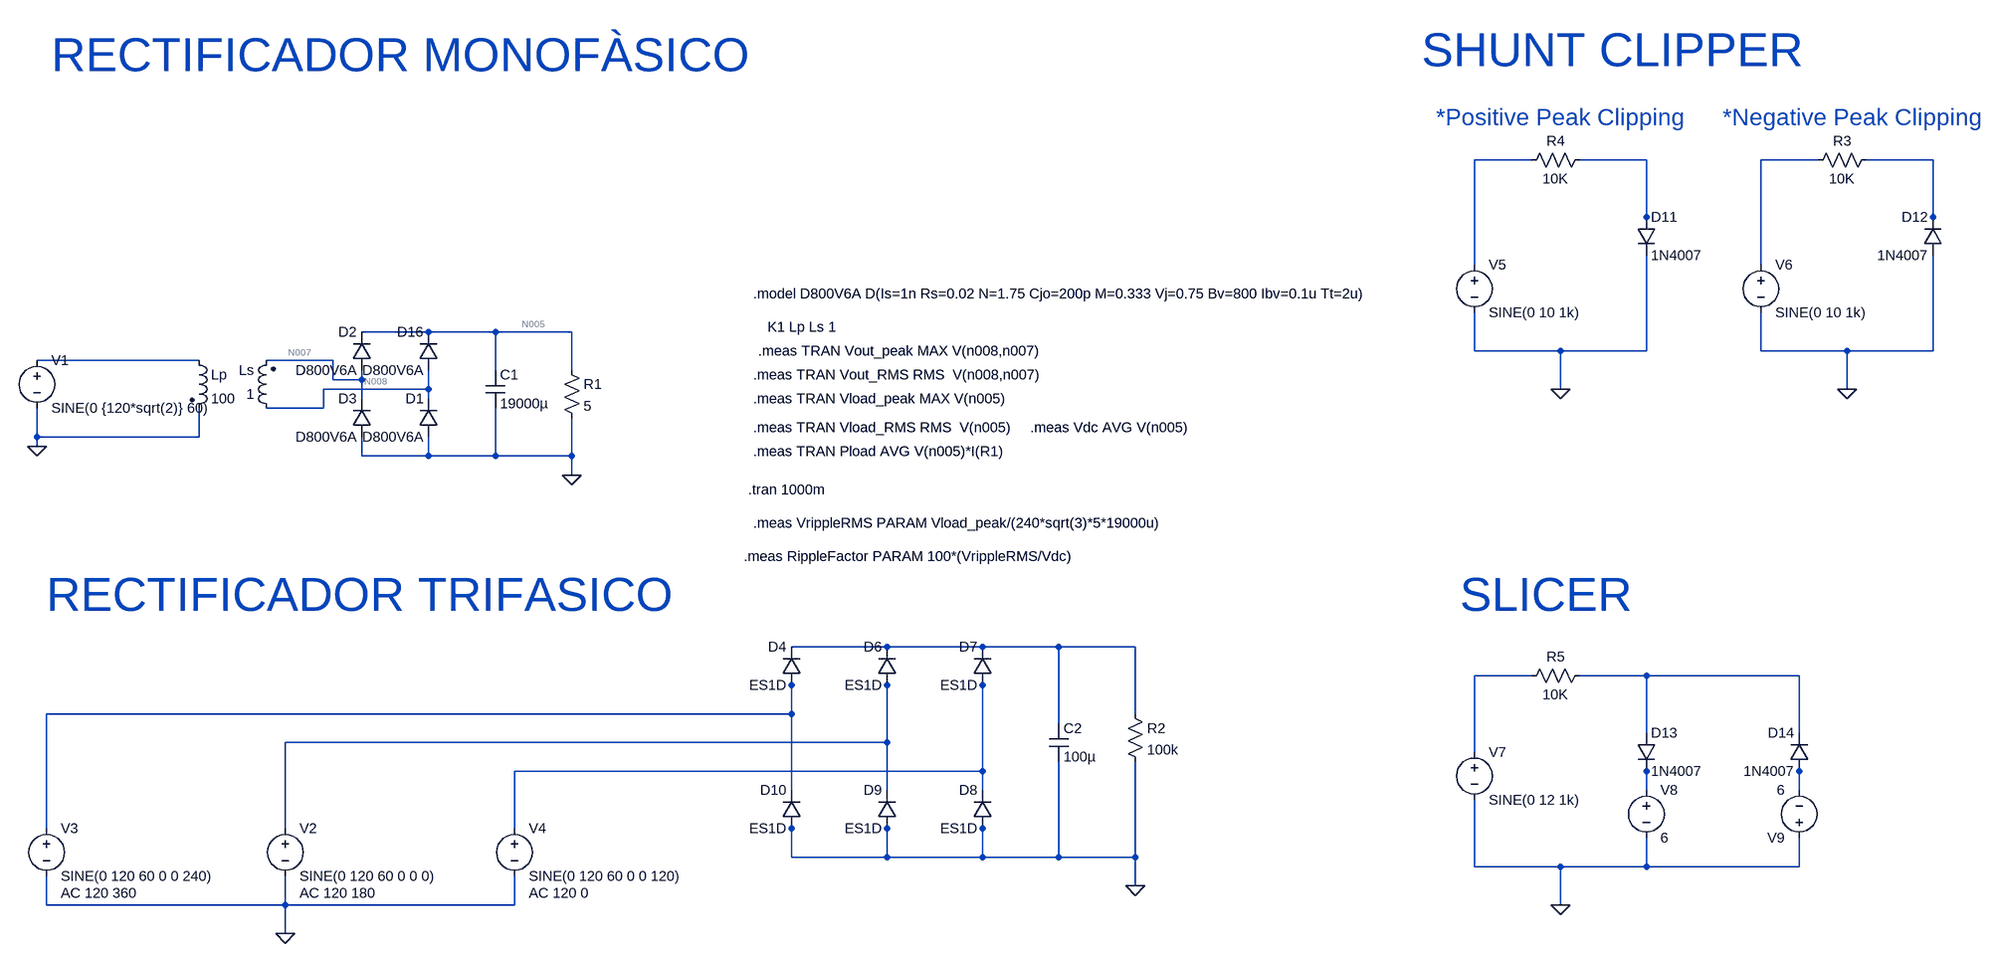
[diagram p0: schematic Rectificadores.asc]
Rectificadores.asc, the LTspice schematic file:
Version 4.1
SHEET 1 2684 1320
WIRE 1584 -128 1488 -128
WIRE 1776 -128 1664 -128
WIRE 2064 -128 1968 -128
WIRE 2256 -128 2144 -128
WIRE 1776 -32 1776 -128
WIRE 2256 -32 2256 -128
WIRE 1776 -16 1776 -32
WIRE 2256 -16 2256 -32
WIRE 1488 48 1488 -128
WIRE 1968 48 1968 -128
WIRE -416 160 -528 160
WIRE -304 160 -416 160
WIRE -176 160 -304 160
WIRE 1488 192 1488 128
WIRE 1632 192 1488 192
WIRE 1776 192 1776 32
WIRE 1776 192 1632 192
WIRE 1968 192 1968 128
WIRE 2112 192 1968 192
WIRE 2256 192 2256 32
WIRE 2256 192 2112 192
WIRE -800 208 -1072 208
WIRE -576 208 -688 208
WIRE -304 224 -304 160
WIRE -176 224 -176 160
WIRE -576 240 -576 208
WIRE -528 240 -528 224
WIRE -528 240 -576 240
WIRE -416 256 -416 224
WIRE -416 256 -592 256
WIRE 1632 256 1632 192
WIRE 2112 256 2112 192
WIRE -528 272 -528 240
WIRE -416 272 -416 256
WIRE -592 288 -592 256
WIRE -592 288 -688 288
WIRE -1072 336 -1072 288
WIRE -800 336 -800 288
WIRE -800 336 -1072 336
WIRE -1072 352 -1072 336
WIRE -528 368 -528 336
WIRE -416 368 -416 336
WIRE -416 368 -528 368
WIRE -304 368 -304 288
WIRE -304 368 -416 368
WIRE -176 368 -176 304
WIRE -176 368 -304 368
WIRE -176 400 -176 368
WIRE 352 688 192 688
WIRE 512 688 352 688
WIRE 640 688 512 688
WIRE 768 688 640 688
WIRE 1584 736 1488 736
WIRE 1776 736 1664 736
WIRE 2032 736 1776 736
WIRE 192 752 192 736
WIRE 352 752 352 736
WIRE 512 752 512 736
WIRE 192 800 192 752
WIRE 192 800 -1056 800
WIRE 768 800 768 688
WIRE 640 816 640 688
WIRE 1776 832 1776 736
WIRE 2032 832 2032 736
WIRE 352 848 352 752
WIRE 352 848 -656 848
WIRE 1488 864 1488 736
WIRE 512 896 512 752
WIRE 512 896 -272 896
WIRE 1776 896 1776 880
WIRE 2032 896 2032 880
WIRE 192 928 192 800
WIRE 352 928 352 848
WIRE 512 928 512 896
WIRE 1776 928 1776 896
WIRE 2032 928 2032 896
WIRE -1056 992 -1056 800
WIRE -656 992 -656 848
WIRE -272 992 -272 896
WIRE 192 992 192 976
WIRE 352 992 352 976
WIRE 512 992 512 976
WIRE 192 1040 192 992
WIRE 352 1040 352 992
WIRE 352 1040 192 1040
WIRE 512 1040 512 992
WIRE 512 1040 352 1040
WIRE 640 1040 640 880
WIRE 640 1040 512 1040
WIRE 768 1040 768 880
WIRE 768 1040 640 1040
WIRE 1488 1056 1488 944
WIRE 1632 1056 1488 1056
WIRE 1776 1056 1776 1008
WIRE 1776 1056 1632 1056
WIRE 2032 1056 2032 1008
WIRE 2032 1056 1776 1056
WIRE 768 1088 768 1040
WIRE -1056 1120 -1056 1072
WIRE -656 1120 -656 1072
WIRE -656 1120 -1056 1120
WIRE -272 1120 -272 1072
WIRE -272 1120 -656 1120
WIRE 1632 1120 1632 1056
WIRE -656 1168 -656 1120
FLAG -176 400 0
FLAG -656 1168 0
FLAG 768 1088 0
FLAG 1632 256 0
FLAG 2112 256 0
FLAG 1632 1120 0
FLAG -1072 352 0
DATAFLAG 768 752 ""
SYMBOL res -192 208 R0
SYMATTR InstName R1
SYMATTR Value 5
SYMBOL diode 208 752 R180
WINDOW 0 24 64 Left 2
WINDOW 3 24 0 Left 2
SYMATTR InstName D4
SYMATTR Value ES1D
SYMBOL res 752 784 R0
SYMATTR InstName R2
SYMATTR Value 100k
SYMBOL voltage -656 976 R0
WINDOW 123 24 124 Left 2
WINDOW 39 0 0 Left 0
SYMATTR Value2 AC 120 180
SYMATTR InstName V2
SYMATTR Value SINE(0 120 60 0 0 0)
SYMBOL voltage -1056 976 R0
WINDOW 123 24 124 Left 2
WINDOW 39 0 0 Left 0
SYMATTR Value2 AC 120 360
SYMATTR InstName V3
SYMATTR Value SINE(0 120 60 0 0 240)
SYMBOL voltage -272 976 R0
WINDOW 123 24 124 Left 2
WINDOW 39 0 0 Left 0
SYMATTR Value2 AC 120 0
SYMATTR InstName V4
SYMATTR Value SINE(0 120 60 0 0 120)
SYMBOL cap 624 816 R0
SYMATTR InstName C2
SYMATTR Value 100µ
SYMATTR SpiceLine V=400
SYMBOL diode 368 752 R180
WINDOW 0 24 64 Left 2
WINDOW 3 24 0 Left 2
SYMATTR InstName D6
SYMATTR Value ES1D
SYMBOL diode 528 752 R180
WINDOW 0 24 64 Left 2
WINDOW 3 24 0 Left 2
SYMATTR InstName D7
SYMATTR Value ES1D
SYMBOL diode 528 992 R180
WINDOW 0 24 64 Left 2
WINDOW 3 24 0 Left 2
SYMATTR InstName D8
SYMATTR Value ES1D
SYMBOL diode 368 992 R180
WINDOW 0 24 64 Left 2
WINDOW 3 24 0 Left 2
SYMATTR InstName D9
SYMATTR Value ES1D
SYMBOL diode 208 992 R180
WINDOW 0 24 64 Left 2
WINDOW 3 24 0 Left 2
SYMATTR InstName D10
SYMATTR Value ES1D
SYMBOL diode 1760 -32 R0
SYMATTR InstName D11
SYMATTR Value 1N4007
SYMBOL voltage 1488 32 R0
WINDOW 123 0 0 Left 0
WINDOW 39 0 0 Left 0
SYMATTR InstName V5
SYMATTR Value SINE(0 10 1k)
SYMBOL res 1680 -144 R90
WINDOW 0 0 56 VBottom 2
WINDOW 3 32 56 VTop 2
SYMATTR InstName R4
SYMATTR Value 10K
SYMBOL diode 2272 32 R180
WINDOW 0 24 64 Left 2
WINDOW 3 24 0 Left 2
SYMATTR InstName D12
SYMATTR Value 1N4007
SYMBOL voltage 1968 32 R0
WINDOW 123 0 0 Left 0
WINDOW 39 0 0 Left 0
SYMATTR InstName V6
SYMATTR Value SINE(0 10 1k)
SYMBOL res 2160 -144 R90
WINDOW 0 0 56 VBottom 2
WINDOW 3 32 56 VTop 2
SYMATTR InstName R3
SYMATTR Value 10K
SYMBOL diode 1760 832 R0
SYMATTR InstName D13
SYMATTR Value 1N4007
SYMBOL voltage 1488 848 R0
WINDOW 123 0 0 Left 0
WINDOW 39 0 0 Left 0
SYMATTR InstName V7
SYMATTR Value SINE(0 12 1k)
SYMBOL res 1680 720 R90
WINDOW 0 0 56 VBottom 2
WINDOW 3 32 56 VTop 2
SYMATTR InstName R5
SYMATTR Value 10K
SYMBOL diode 2048 896 R180
WINDOW 0 24 64 Left 2
WINDOW 3 24 0 Left 2
SYMATTR InstName D14
SYMATTR Value 1N4007
SYMBOL voltage 1776 912 R0
WINDOW 123 0 0 Left 0
WINDOW 39 0 0 Left 0
SYMATTR InstName V8
SYMATTR Value 6
SYMBOL voltage 2032 1024 R180
WINDOW 123 0 0 Left 0
WINDOW 39 0 0 Left 0
SYMATTR InstName V9
SYMATTR Value 6
SYMBOL diode -512 336 R180
WINDOW 0 24 64 Left 2
WINDOW 3 24 0 Left 2
SYMATTR InstName D3
SYMATTR Value D800V6A
SYMBOL diode -400 224 R180
WINDOW 0 24 64 Left 2
WINDOW 3 24 0 Left 2
SYMATTR InstName D16
SYMATTR Value D800V6A
SYMBOL diode -512 224 R180
WINDOW 0 24 64 Left 2
WINDOW 3 24 0 Left 2
SYMATTR InstName D2
SYMATTR Value D800V6A
SYMBOL diode -400 336 R180
WINDOW 0 24 64 Left 2
WINDOW 3 24 0 Left 2
SYMATTR InstName D1
SYMATTR Value D800V6A
SYMBOL voltage -1072 192 R0
WINDOW 123 0 0 Left 0
WINDOW 39 0 0 Left 0
SYMATTR InstName V1
SYMATTR Value SINE(0 {120*sqrt(2)} 60)
SYMBOL ind2 -816 192 R0
SYMATTR InstName Lp
SYMATTR Value 100
SYMATTR SpiceLine Rser=37
SYMBOL ind2 -672 304 R180
WINDOW 0 36 80 Left 2
WINDOW 3 36 40 Left 2
SYMATTR InstName Ls
SYMATTR Value 1
SYMATTR SpiceLine Rser=3.7
SYMBOL cap -320 224 R0
SYMATTR Value 19000µ
SYMATTR InstName C1
SYMATTR SpiceLine V=63 Irms=4.69 Rser=0.0175 Lser=20.255n mfg="Würth Elektronik" pn="861140786024 WCAP-AI3H 35x52" type="Al electrolytic"
TEXT 120 424 Left 2 !.tran 1000m
TEXT -1056 600 Left 6 ;RECTIFICADOR TRIFASICO
TEXT -1048 -304 Left 6 ;RECTIFICADOR MONOFÀSICO
TEXT 1400 -312 Left 6 ;SHUNT CLIPPER
TEXT 1424 -200 Left 4 ;*Positive Peak Clipping
TEXT 1904 -200 Left 4 ;*Negative Peak Clipping
TEXT 1464 600 Left 6 ;SLICER
TEXT 128 96 Left 2 !.model D800V6A D(Is=1n Rs=0.02 N=1.75 Cjo=200p M=0.333 Vj=0.75 Bv=800 Ibv=0.1u Tt=2u)
TEXT 152 152 Left 2 !K1 Lp Ls 1
TEXT 136 192 Left 2 !.meas TRAN Vout_peak MAX V(n008,n007)
TEXT 128 232 Left 2 !.meas TRAN Vout_RMS RMS  V(n008,n007)
TEXT 128 272 Left 2 !.meas TRAN Vload_peak MAX V(n005)
TEXT 128 320 Left 2 !.meas TRAN Vload_RMS RMS  V(n005)
TEXT 128 360 Left 2 !.meas TRAN Pload AVG V(n005)*I(R1)
TEXT 592 320 Left 2 !.meas Vdc AVG V(n005)
TEXT 128 480 Left 2 !.meas VrippleRMS PARAM Vload_peak/(240*sqrt(3)*5*19000u)
TEXT 112 536 Left 2 !.meas RippleFactor PARAM 100*(VrippleRMS/Vdc)

The netlist it stands for:
* Rectificadores.asc
R1 N005 0 5
D4 N012 N009 ES1D
R2 N009 0 100k
V2 N013 0 SINE(0 120 60 0 0 0) AC 120 180
V3 N012 0 SINE(0 120 60 0 0 240) AC 120 360
V4 N014 0 SINE(0 120 60 0 0 120) AC 120 0
C2 N009 0 100µ V=400
D6 N013 N009 ES1D
D7 N014 N009 ES1D
D8 0 N014 ES1D
D9 0 N013 ES1D
D10 0 N012 ES1D
D11 N002 0 1N4007
V5 N001 0 SINE(0 10 1k)
R4 N002 N001 10K
D12 0 N004 1N4007
V6 N003 0 SINE(0 10 1k)
R3 N004 N003 10K
D13 N011 N015 1N4007
V7 N010 0 SINE(0 12 1k)
R5 N011 N010 10K
D14 N016 N011 1N4007
V8 N015 0 6
V9 0 N016 6
D3 0 N007 D800V6A
D16 N008 N005 D800V6A
D2 N007 N005 D800V6A
D1 0 N008 D800V6A
V1 N006 0 SINE(0 {120*sqrt(2)} 60)
Lp N006 0 100 Rser=37
Ls N008 N007 1 Rser=3.7
C1 N005 0 19000µ V=63 Irms=4.69 Rser=0.0175 Lser=20.255n mfg="Würth Elektronik" pn="861140786024 WCAP-AI3H 35x52" type="Al electrolytic"
.model D D
.lib standard.dio
.tran 1000m
* RECTIFICADOR TRIFASICO
* RECTIFICADOR MONOFÀSICO
* SHUNT CLIPPER
* *Positive Peak Clipping
* *Negative Peak Clipping
* SLICER
.model D800V6A D(Is=1n Rs=0.02 N=1.75 Cjo=200p M=0.333 Vj=0.75 Bv=800 Ibv=0.1u Tt=2u)
K1 Lp Ls 1
.meas TRAN Vout_peak MAX V(n008,n007)
.meas TRAN Vout_RMS RMS  V(n008,n007)
.meas TRAN Vload_peak MAX V(n005)
.meas TRAN Vload_RMS RMS  V(n005)
.meas TRAN Pload AVG V(n005)*I(R1)
.meas Vdc AVG V(n005)
.meas VrippleRMS PARAM Vload_peak/(240*sqrt(3)*5*19000u)
.meas RippleFactor PARAM 100*(VrippleRMS/Vdc)
.backanno
.end